# Altium schematic sheet Schematic.SchDoc
size A4; SheetNumber: 1; SheetTotal: 1
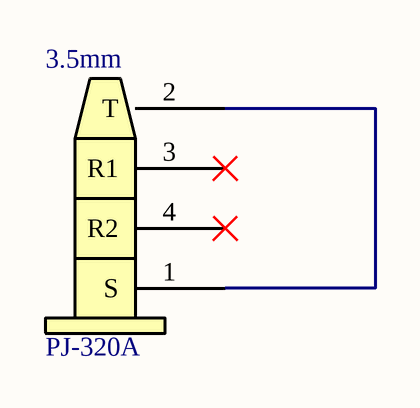
[diagram p0: Schematic.SchDoc]

## Parts
3.5mm  PJ-320A

## Nets
Net3.5mm_1: 3.5mm.1(S) 3.5mm.2(T)

Not connected (* = marked no-connect by the designer): 3.5mm 3(R1)* 4(R2)*

## Library data of the parts
3.5mm = CMP-002-00074-1: A thru hole 3.5mm TRRS audio jack connector; Design Item ID: PJ-320A; Source: PJ-320A.SchLib